# EAGLE board Replicape (EAGLE 5.12), part 1 of 2
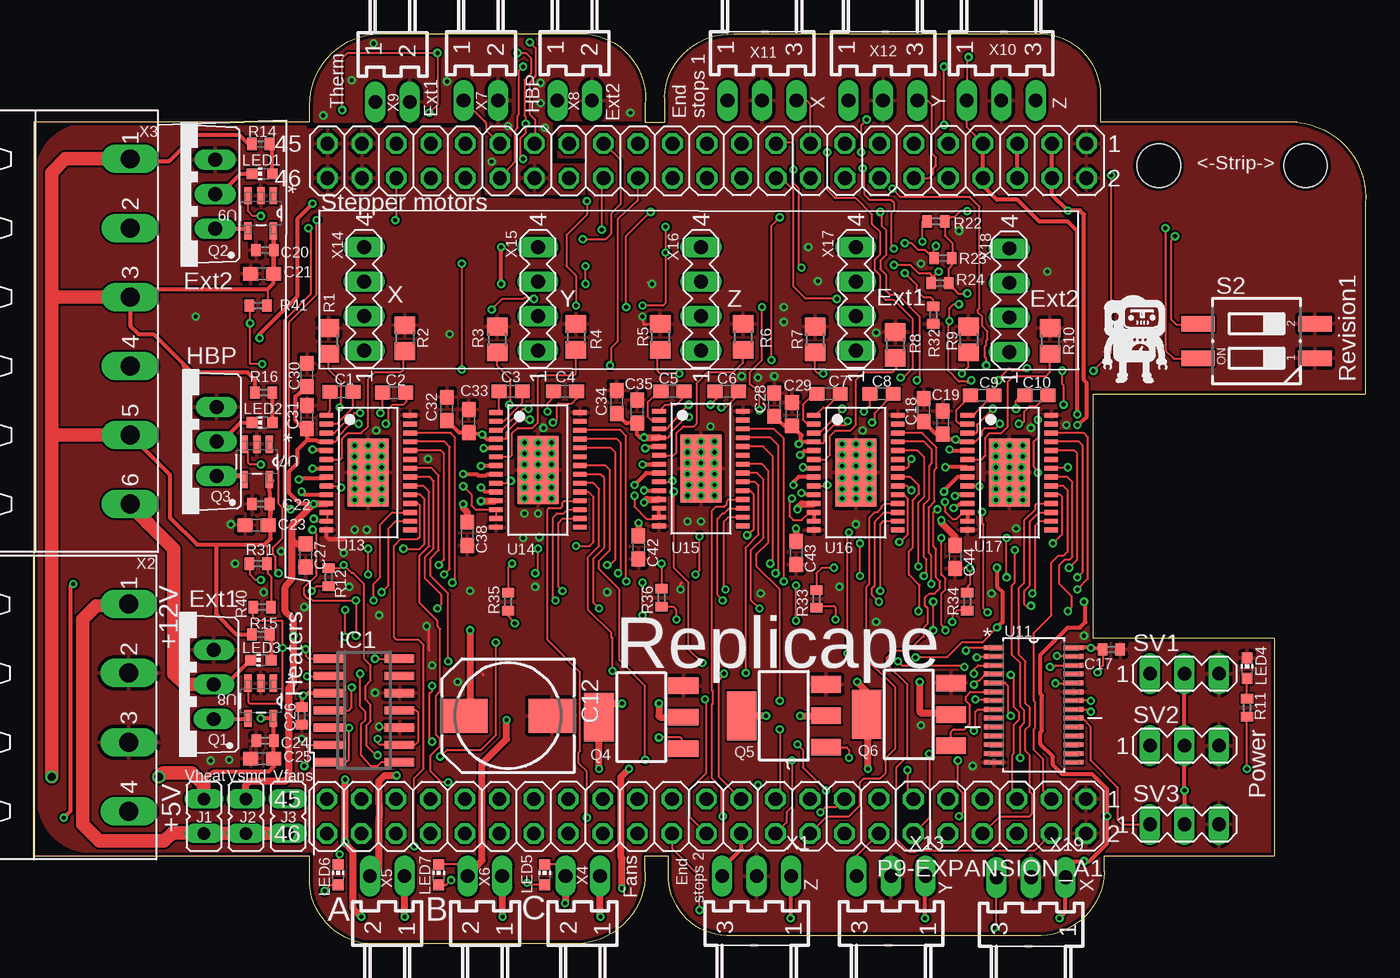
[diagram p2: board, top side]
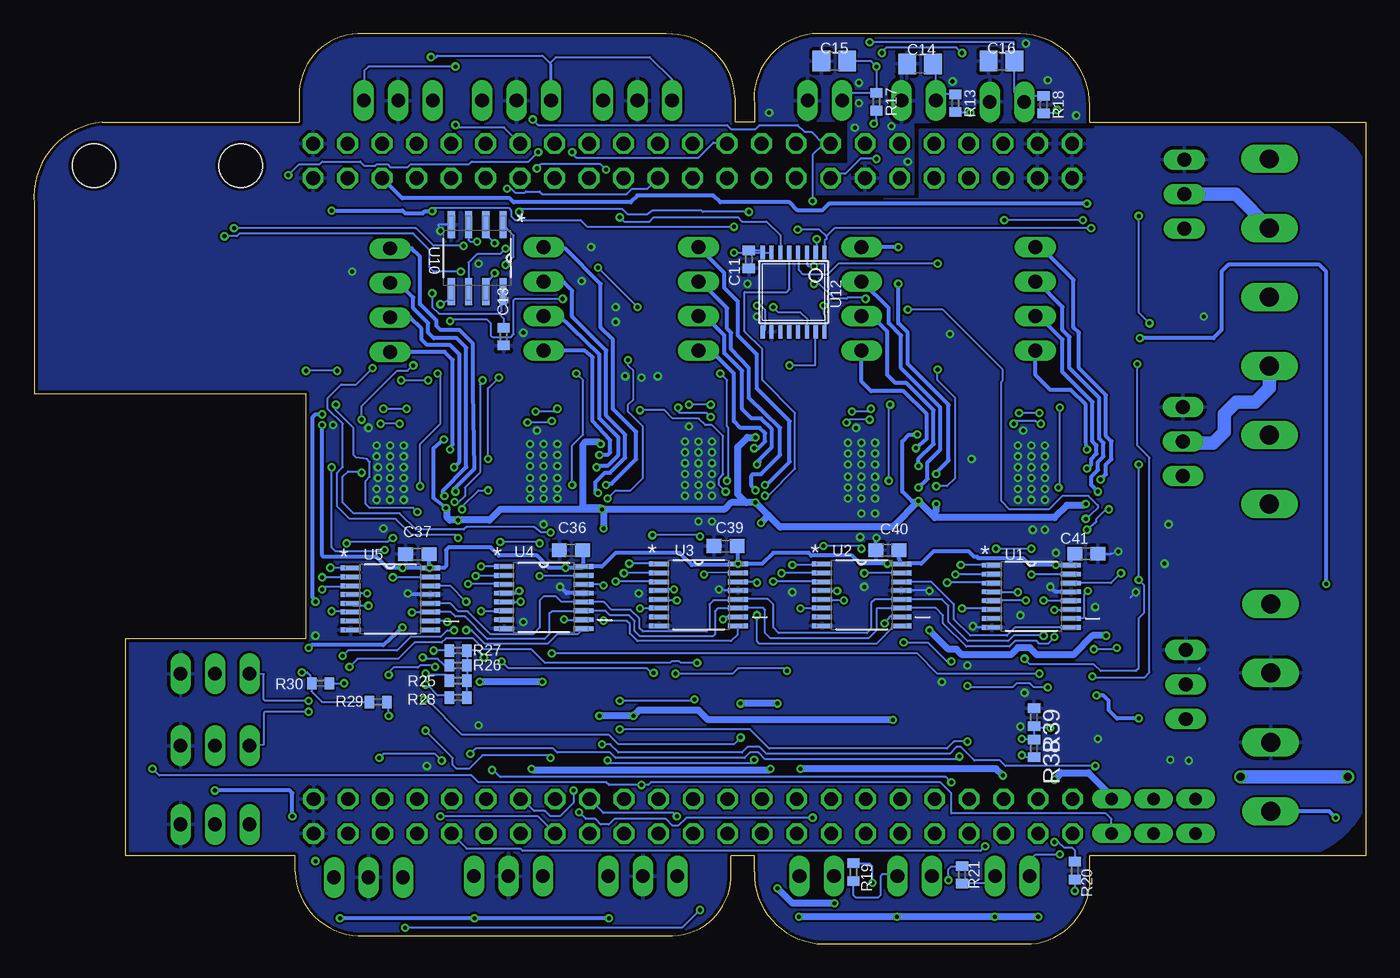
[diagram p3: board, bottom side, seen from below]

Size 98.02 x 67 mm. Coordinates in mm from the lower left corner, seen from the top.
Outline: 45,6.5 46.7,6.5 46.7,5.2 arc90 51,0.6 73.7,0.6 arc90 78.8,5.3 78.8,6.5 91.3,6.5 91.3,22.5 78,22.5 78,40.5 98,40.5 98,54.5 arc90 93,60.5 78.5,60.5 78.5,62.4 arc90 74.2,67 51.5,67 arc90 46.4,62.3 46.4,60.5 45,60.5 45,61.8 arc90 40.7,67 25.4,67 arc90 20.3,61.7 20.3,60.5 0,60.5 0,6.5 20.3,6.5 20.3,5.2 arc90 24.6,0 39.9,0 arc90 45,5.3 45,6.5
Copper layers (1*16): Top 0.035mm / dielectric 1.5mm / Bottom 0.035mm
Design rules "Fusion_eagle_rule_v1.1 *": minimum track width 6mil, minimum drill 0.3mm, track to track 6mil, track to pad 6mil, pad to pad 6mil, via to via 6mil, smd to smd 0mil, copper to edge 10mil, drill to drill 10mil, minimum pad ring 10mil, minimum via ring 6mil, stop-mask expansion 2mil, vias tented up to drill 100mil, thermal gap 10mil
Net classes: 1 power: width 1.27 mm
Holes 3.2 mm at 82.8,57.3 93.6,57.3

## Footprints (pad centres in the part's own frame; a part is rotated, then mirrored left to right if it is on the bottom)
C0603 = smd 1.1 x 1: 1 -0.85,0; 2 0.85,0
C0402 = smd 0.7 x 0.9: 1 -0.65,0; 2 0.65,0
140CLH-0810 = smd 3.5 x 2.5: + 3.25,0; - -3.25,0
C0805 = smd 1.3 x 1.5: 1 -0.95,0; 2 0.95,0
SO14 = smd 0.6 x 2.2: 1 -3.81,-2.6; 2 -2.54,-2.6; 3 -1.27,-2.6; 4 0,-2.6; 5 1.27,-2.6; 6 2.54,-2.6; 7 3.81,-2.6; 8 3.81,2.6; 9 2.54,2.6; 10 1.27,2.6; 11 0,2.6; 12 -1.27,2.6; 13 -2.54,2.6; 14 -3.81,2.6
JP1 = drill 0.914 long: 1 0,-1.27; 2 0,1.27
CHIP-LED0603 = smd 0.8 x 0.8: A 0,-0.75; C 0,0.75
2X23-R = drill 1.016 octagon: 1 -27.94,-1.27; 2 -27.94,1.27; 3 -25.4,-1.27; 4 -25.4,1.27; 5 -22.86,-1.27; 6 -22.86,1.27; 7 -20.32,-1.27; 8 -20.32,1.27; 9 -17.78,-1.27; 10 -17.78,1.27; 11 -15.24,-1.27; 12 -15.24,1.27; 13 -12.7,-1.27; 14 -12.7,1.27; 15 -10.16,-1.27; 16 -10.16,1.27; 17 -7.62,-1.27; 18 -7.62,1.27; 19 -5.08,-1.27; 20 -5.08,1.27; 21 -2.54,-1.27; 22 -2.54,1.27; 23 0,-1.27; 24 0,1.27; 25 2.54,-1.27; 26 2.54,1.27; 27 5.08,-1.27; 28 5.08,1.27; 29 7.62,-1.27; 30 7.62,1.27; 31 10.16,-1.27; 32 10.16,1.27; 33 12.7,-1.27; 34 12.7,1.27; 35 15.24,-1.27; 36 15.24,1.27; 37 17.78,-1.27; 38 17.78,1.27; 39 20.32,-1.27; 40 20.32,1.27; 41 22.86,-1.27; 42 22.86,1.27; 43 25.4,-1.27; 44 25.4,1.27; 45 27.94,-1.27; 46 27.94,1.27
TO220BV = drill 1.016 long: D 0,-2.54; G -2.54,-2.54; S 2.54,-2.54
SOT223 = smd 1.219 x 2.235: 1 -2.311,-3.099; 2 0,-3.099; 3 2.311,-3.099 | smd 3.6 x 2.2: 4 0,3.099
R0805 = smd 1.3 x 1.5: 1 -0.95,0; 2 0.95,0
R0402 = smd 0.7 x 0.9: 1 -0.65,0; 2 0.65,0
CTS-219-02 = smd 1.13 x 2.44: 1 -1.27,-4.3; 2 1.27,-4.3; 3 1.27,4.3; 4 -1.27,4.3
MA03-1 = drill 1.016 long: 1 -2.54,0; 2 0,0; 3 2.54,0
SOP65P640X120-16N = smd 1.473 x 0.356: 1 -2.921,2.286; 2 -2.921,1.626; 3 -2.921,0.965; 4 -2.921,0.33; 5 -2.921,-0.33; 6 -2.921,-0.965; 7 -2.921,-1.626; 8 -2.921,-2.286; 9 2.921,-2.286; 10 2.921,-1.626; 11 2.921,-0.965; 12 2.921,-0.33; 13 2.921,0.33; 14 2.921,0.965; 15 2.921,1.626; 16 2.921,2.286
SOT95P280X145-5N = smd 1.27 x 0.559: 1 -1.295,0.94; 2 -1.295,0; 3 -1.295,-0.94; 4 1.295,-0.94; 5 1.295,0.94
SOIC127P600X175-8N = smd 1.981 x 0.533: 1 -2.464,1.905; 2 -2.464,0.635; 3 -2.464,-0.635; 4 -2.464,-1.905; 5 2.464,-1.905; 6 2.464,-0.635; 7 2.464,0.635; 8 2.464,1.905
SOP65P640X110-28N = smd 1.473 x 0.356: 1 -2.921,4.216; 2 -2.921,3.581; 3 -2.921,2.921; 4 -2.921,2.286; 5 -2.921,1.626; 6 -2.921,0.965; 7 -2.921,0.33; 8 -2.921,-0.33; 9 -2.921,-0.965; 10 -2.921,-1.626; 11 -2.921,-2.286; 12 -2.921,-2.921; 13 -2.921,-3.581; 14 -2.921,-4.216; 15 2.921,-4.216; 16 2.921,-3.581; 17 2.921,-2.921; 18 2.921,-2.286; 19 2.921,-1.626; 20 2.921,-0.965; 21 2.921,-0.33; 22 2.921,0.33; 23 2.921,0.965; 24 2.921,1.626; 25 2.921,2.286; 26 2.921,2.921; 27 2.921,3.581; 28 2.921,4.216
TSSOP-16 = smd 0.305 x 0.991: 1 -2.275,-2.918; 2 -1.625,-2.918; 3 -0.975,-2.918; 4 -0.325,-2.918; 5 0.325,-2.918; 6 0.975,-2.918; 7 1.625,-2.918; 8 2.275,-2.918; 9 2.275,2.918; 10 1.625,2.918; 11 0.975,2.918; 12 0.325,2.918; 13 -0.325,2.918; 14 -0.975,2.918; 15 -1.625,2.918; 16 -2.275,2.918
TSSOP-28 = smd 0.35 x 1: 1 -4.225,-3.087; 2 -3.575,-3.087; 3 -2.925,-3.087; 4 -2.275,-3.087; 5 -1.625,-3.087; 6 -0.975,-3.087; 7 -0.325,-3.087; 8 0.325,-3.087; 9 0.975,-3.087; 10 1.625,-3.087; 11 2.275,-3.087; 12 2.925,-3.087; 13 3.575,-3.087; 14 4.225,-3.087; 15 4.225,3.087; 16 3.575,3.087; 17 2.925,3.087; 18 2.275,3.087; 19 1.625,3.087; 20 0.975,3.087; 21 0.325,3.087; 22 -0.325,3.087; 23 -0.975,3.087; 24 -1.625,3.087; 25 -2.275,3.087; 26 -2.925,3.087; 27 -3.575,3.087; 28 -4.225,3.087 | smd 5 x 3: EXP 0,0
7395-03 = drill 1.016 long: 1 2.54,0; 2 0,0; 3 -2.54,0
MSTBA4 = drill 1.397 long: 1 -7.62,5.08; 2 -2.54,5.08; 3 2.54,5.08; 4 7.62,5.08
MSTBA6 = drill 1.397 long: 1 -12.7,5.08; 2 -7.62,5.08; 3 -2.54,5.08; 4 2.54,5.08; 5 7.62,5.08; 6 12.7,5.08
7395-02 = drill 1.016 long: 1 1.27,0; 2 -1.27,0
MA04-1 = drill 1.016 long: 1 -3.81,0; 2 -1.27,0; 3 1.27,0; 4 3.81,0

## Placement (x,y rotation side)
C1  10nF  [C0603]  22.65,40.65 180 top
C2  0.1uF  [C0603]  26.5,40.6 180 top
C3  10nF  [C0603]  35.1,40.7 180 top
C4  0.1uF  [C0603]  39.1,40.7 180 top
C5  10nF  [C0603]  47,40.7 0 top
C6  0.1uF  [C0603]  51,40.7 180 top
C7  10nF  [C0603]  58.5,40.5 0 top
C8  0.1uF  [C0603]  62.4,40.5 180 top
C9  10nF  [C0603]  69.8,40.4 0 top
C10  0.1uF  [C0603]  73.8,40.4 180 top
C11  0.1uF  [C0402]  45.4,50.4 270 bottom
C12  100uF  [140CLH-0810]  34.9,16.8 180 top
C13  0.1uF  [C0402]  63.45,44.71 270 bottom
C14  10uF  [C0805]  32.8,64.8 180 bottom
C15  10uF  [C0805]  39.1,65 180 bottom
C16  10uF  [C0805]  26.8,65 180 bottom
C17  0.1uF  [C0402]  79.32,21.68 0 top
C18  4.7uF  [C0603]  65.5,39.3 90 top
C19  0.1uF  [C0603]  66.9,38.4 90 top
C20  0.1uF  [C0402]  17,51.08 180 top
C21  4.7uF  [C0603]  16.8,49.35 180 top
C22  0.1uF  [C0402]  16.7,32.4 180 top
C23  4.7uF  [C0603]  16.39,30.84 180 top
C24  0.1uF  [C0402]  17.01,14.97 180 top
C25  4.7uF  [C0603]  16.81,13.65 180 top
C26  0.1uF  [C0402]  19.7,16.8 270 top
C27  0.1uF  [C0603]  20,28.6 270 top
C28  4.7uF  [C0603]  54.5,39.7 90 top
C29  0.1uF  [C0603]  55.8,39 90 top
C30  4.7uF  [C0603]  20.1,41.9 90 top
C31  0.1uF  [C0603]  20.1,38.8 90 top
C32  4.7uF  [C0603]  30.4,39.4 90 top
C33  0.1uF  [C0603]  32,38.5 90 top
C34  4.7uF  [C0603]  42.9,39.9 90 top
C35  0.1uF  [C0603]  44.4,39.2 90 top
C36  0.1uF  [C0603]  58.5,29 180 bottom
C37  0.1uF  [C0603]  69.8,28.7 180 bottom
C38  0.1uF  [C0603]  31.9,30.2 270 top
C39  0.1uF  [C0603]  47.1,29.3 180 bottom
C40  0.1uF  [C0603]  35.2,29 180 bottom
C41  0.1uF  [C0603]  20.56,28.73 0 bottom
C42  0.1uF  [C0603]  44.5,29.2 270 top
C43  0.1uF  [C0603]  56.1,28.8 270 top
C44  0.1uF  [C0603]  67.8,28.5 270 top
IC1  LM339D  [SO14]  24.3,17.2 270 top
J1  [JP1]  12.5,9.4 0 top
J2  [JP1]  15.6,9.4 0 top
J3  [JP1]  18.7,9.4 0 top
LED1  green  [CHIP-LED0603]  16.8,56.7 90 top
LED2  green  [CHIP-LED0603]  16.8,38.4 90 top
LED3  green  [CHIP-LED0603]  16.7,20.9 90 top
LED4  green  [CHIP-LED0603]  89.3,20.3 0 top
LED5  green  [CHIP-LED0603]  37.6,5.1 0 top
LED6  green  [CHIP-LED0603]  22.4,5.1 0 top
LED7  green  [CHIP-LED0603]  29.8,5.1 0 top
P9-EXPANSION_A  BEAGLE_EXT9  [2X23-R]  49.54,57.66 180 top
P9-EXPANSION_A1  BEAGLE_EXT9  [2X23-R]  49.5,9.4 180 top
Q1  [TO220BV]  10.7,19.1 90 top
Q2  [TO220BV]  10.8,55.2 90 top
Q3  [TO220BV]  10.9,37 90 top
Q4  NIF5002  [SOT223]  44.7,16.7 90 top
Q5  NIF5002  [SOT223]  55.2,16.8 90 top
Q6  NIF5002  [SOT223]  64.4,16.9 90 top
R1  0.1R  [R0805]  21.7,44.4 270 top
R2  0.1R  [R0805]  27.3,44.6 270 top
R3  0.1R  [R0805]  34.1,44.5 270 top
R4  0.1R  [R0805]  39.9,44.7 270 top
R5  0.1R  [R0805]  46.1,44.7 270 top
R6  0.1R  [R0805]  52.2,44.7 270 top
R7  0.1R  [R0805]  57.5,44.5 270 top
R8  0.1R  [R0805]  63.4,44.1 270 top
R9  0.1R  [R0805]  68.8,44.5 270 top
R10  0.1R  [R0805]  74.8,44.4 270 top
R11  1K  [R0402]  89.3,17.4 270 top
R12  1K  [R0402]  21.7,27 90 top
R13  4K7  [R0402]  30.2,61.9 270 bottom
R14  1K  [R0402]  16.7,58.9 180 top
R15  1K  [R0402]  16.7,22.8 180 top
R16  1K  [R0402]  16.9,40.6 180 top
R17  4K7  [R0402]  36,62 270 bottom
R18  4K7  [R0402]  23.7,61.8 270 bottom
R19  1K  [R0402]  37.7,5.3 270 bottom
R20  1K  [R0402]  21.4,5.4 90 bottom
R21  1K  [R0402]  29.7,5.1 270 bottom
R22  5.6K  [R0402]  66.4,53.2 0 top
R23  5.6K  [R0402]  66.9,50.5 0 top
R24  5.6K  [R0402]  66.7,48.65 0 top
R25  1K  [R0402]  66.81,19.39 0 bottom
R26  1K  [R0402]  66.8,20.5 0 bottom
R27  1K  [R0402]  66.8,21.6 0 bottom
R28  1K  [R0402]  66.8,18.14 0 bottom
R29  1K  [R0402]  72.69,17.81 180 bottom
R30  1K  [R0402]  76.93,19.19 180 bottom
R31  4K7  [R0402]  16.5,28 0 top
R32  1K-DNP  [R0402]  66.2,46.3 90 top
R33  1K  [R0402]  57.6,25.4 90 top
R34  1K  [R0402]  68.7,25.2 90 top
R35  1K  [R0402]  34.9,25.2 90 top
R36  1K  [R0402]  46.2,25.5 90 top
R38  4K7  [R0402]  24.4,14.4 270 bottom
R39  4K7  [R0402]  24.4,16.7 270 bottom
R40  4K7  [R0402]  16.8,24.8 0 top
R41  4K7  [R0402]  16.5,47 0 top
S2  219-02  [CTS-219-02]  90,44.4 90 top
SV1  [MA03-1]  84.7,19.9 0 top
SV2  [MA03-1]  84.7,14.6 0 top
SV3  [MA03-1]  84.7,8.8 0 top
U1  SN74AHC595PW  [SOP65P640X120-16N]  24.6,25.6 0 bottom
U2  SN74AHC595PW  [SOP65P640X120-16N]  37.1,25.7 0 bottom
U3  SN74AHC595PW  [SOP65P640X120-16N]  49.1,25.7 0 bottom
U4  SN74AHC595PW  [SOP65P640X120-16N]  60.5,25.5 0 bottom
U5  SN74AHC595PW  [SOP65P640X120-16N]  71.8,25.4 0 bottom
U7  TPS2829DBVT  [SOT95P280X145-5N]  16.4,35.5 270 top
U8  TPS2829DBVT  [SOT95P280X145-5N]  16.7,17.9 270 top
U9  TPS2829DBVT  [SOT95P280X145-5N]  16.7,53.8 270 top
U10  M24C16-WMN6P  [SOIC127P600X175-8N]  65.4,50.5 270 bottom
U11  PCA9685PW  [SOP65P640X110-28N]  73.6,17.6 0 top
U12  DAC088S085  [TSSOP-16]  42.1,48 180 bottom
U13  DRV8825PWP  [TSSOP-28]  24.6,34.7 270 top
U14  DRV8825PWP  [TSSOP-28]  37.1,34.9 270 top
U15  DRV8825PWP  [TSSOP-28]  49.1,35 270 top
U16  DRV8825PWP  [TSSOP-28]  60.5,34.7 270 top
U17  DRV8825PWP  [TSSOP-28]  71.8,34.7 270 top
U$1  [LOGO_BIG]  80.6,44.6 0 top
X1  22-05-7038-03  [7395-03]  53.2,5 0 top
X2  MSTBA4  [MSTBA4]  1.9,17.4 270 top
X3  MSTBA6  [MSTBA6]  2,45.1 270 top
X4  22-05-7028-02  [7395-02]  40.4,5 0 top
X5  22-05-7028-02  [7395-02]  26,5 0 top
X6  22-05-7028-02  [7395-02]  33.2,5 0 top
X7  22-05-7028-02  [7395-02]  32.9,62.1 180 top
X8  22-05-7028-02  [7395-02]  39.8,62.1 180 top
X9  22-05-7028-02  [7395-02]  26.4,62 180 top
X10  22-05-7038-03  [7395-03]  71.2,62.1 180 top
X11  22-05-7038-03  [7395-03]  53.6,62.1 180 top
X12  22-05-7038-03  [7395-03]  62.5,62.1 180 top
X13  22-05-7038-03  [7395-03]  63.1,5 0 top
X14  [MA04-1]  24.3,47.5 90 top
X15  [MA04-1]  37.1,47.5 90 top
X16  [MA04-1]  49.1,47.5 90 top
X17  [MA04-1]  60.5,47.5 90 top
X18  [MA04-1]  71.8,47.4 90 top
X19  22-05-7038-03  [7395-03]  73.4,4.9 0 top